# EAGLE design ThousandSunny (EAGLE 9.6.2)
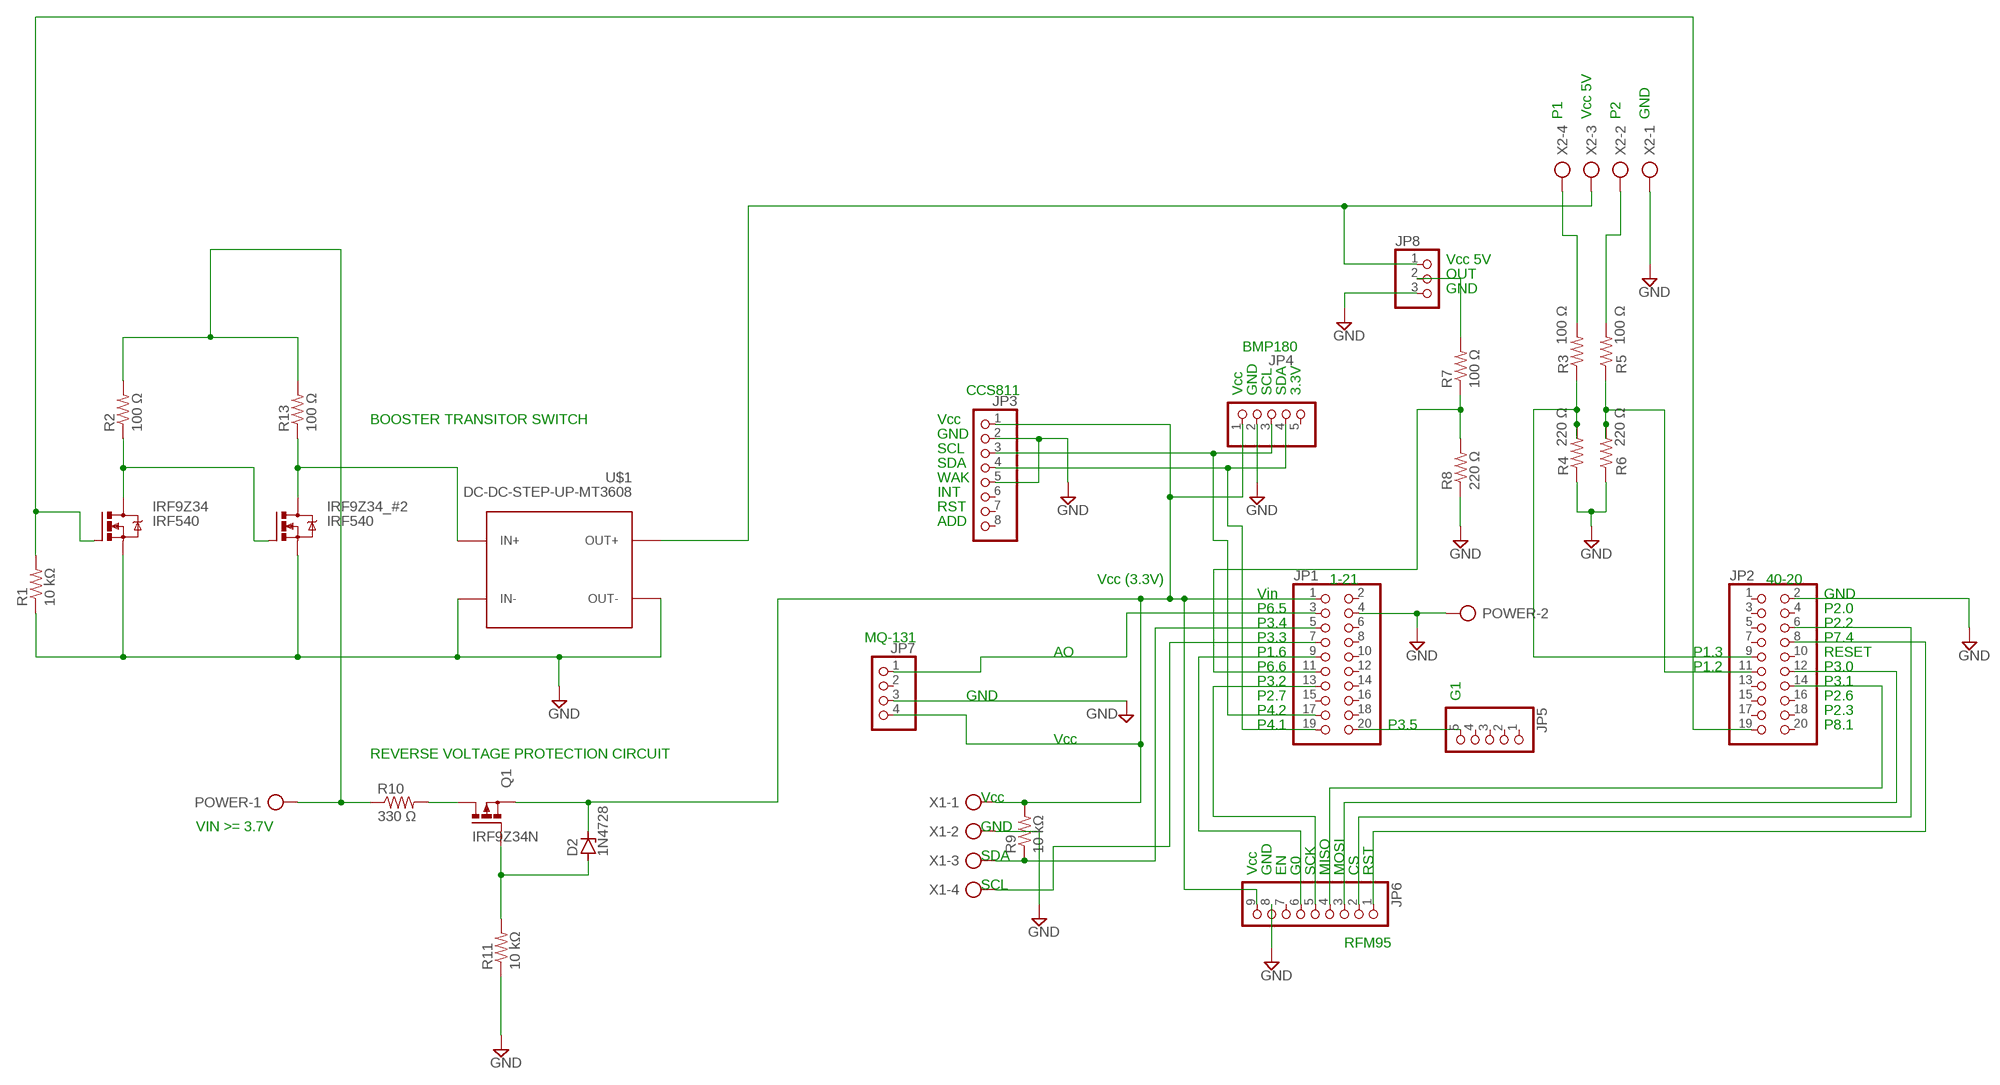
[diagram p0: schematic, sheet 1]

## Parts
D2  1N4728  [DO41Z10]
IRF9Z34  IRF540  [TO220BV]
IRF9Z34_#2  IRF540  [TO220BV]
JP1  PINHD-2X10  [2X10]
JP2  PINHD-2X10  [2X10]
JP3  PINHD-1X8  [1X08]
JP4  PINHD-1X5  [1X05]
JP5  PINHD-1X5  [1X05]
JP6  PINHD-1X9  [1X09]
JP7  PINHD-1X4  [1X04]
JP8  PINHD-1X3  [1X03]
POWER  AK300/2  [AK300/2]
Q1  IRF9Z34N  PMOSFET_PTO220BV  [TO220BV]
R1  10 kΩ  R-US_0204/7  [0204/7]
R2  100 Ω  R-US_0204/7  [0204/7]
R3  100 Ω  R-US_0204/7  [0204/7]
R4  220 Ω  R-US_0204/7  [0204/7]
R5  100 Ω  R-US_0204/7  [0204/7]
R6  220 Ω  R-US_0204/7  [0204/7]
R7  100 Ω  R-US_0204/7  [0204/7]
R8  220 Ω  R-US_0204/7  [0204/7]
R9  10 kΩ  R-US_0204/7  [0204/7]
R10  330 Ω  R-US_0204/7  [0204/7]
R11  10 kΩ  R-US_0204/7  [0204/7]
R13  100 Ω  R-US_0204/7  [0204/7]
U$1  DC-DC-STEP-UP-MT3608  [DC-DC-STEP-UP-MT3608]
X1  AK300/4  [AK300/4]
X2  AK300/4  [AK300/4]

## Nets
ANODE: D2.A Q1.G R11.2
BATTERY: POWER.1 R2.2 R10.1 R13.2
D1->G2: IRF9Z34.D IRF9Z34_#2.G R2.1
D2->VIN: IRF9Z34_#2.D R13.1 U$1.IN+
DRAIN_Q1: Q1.D R10.2
DUST_P1: JP2.9 R3.1 R4.2
DUST_P2: JP2.11 R5.1 R6.2
G1: JP1.20 JP5.5
GND: IRF9Z34.S IRF9Z34_#2.S JP1.4 JP2.2 JP3.2 JP3.5 JP4.2 JP6.8 JP7.3 JP8.3 POWER.2 R1.1 R4.1 R6.1 R8.1 R11.1 U$1.IN- U$1.OUT- X1.2 X2.1
MISO: JP2.14 JP6.4
MOSI: JP2.12 JP6.3
O3: JP1.3 JP7.1
P8.2: IRF9Z34.G JP2.19 R1.2
RAW_P1: R3.2 X2.4
RAW_P2: R5.2 X2.2
RAW_SOLAR: JP8.2 R7.2
RFM95_RST: JP2.8 JP6.1
RFM95W_CS: JP2.6 JP6.2
RFM95W_G0: JP1.9 JP6.6
SCK: JP1.13 JP6.5
SCL: JP1.17 JP3.3 JP4.3
SDA: JP1.19 JP3.4 JP4.4
SHT_CLOCK: JP1.7 X1.4
SHT_DATA: JP1.5 R9.1 X1.3
SOLAR: JP1.11 R7.1 R8.2
VIN->DUST: JP8.1 U$1.OUT+ X2.3
VZ->3.3V: D2.C JP1.1 JP3.1 JP4.1 JP6.9 JP7.4 Q1.S R9.2 X1.1
Unconnected: JP1.2 JP1.6 JP1.8 JP1.10 JP1.12 JP1.14 JP1.15 JP1.16 JP1.18 JP2.1 JP2.3 JP2.4 JP2.5 JP2.7 JP2.10 JP2.13 JP2.15 JP2.16 JP2.17 JP2.18 JP2.20 JP3.6 JP3.7 JP3.8 JP4.5 JP5.1 JP5.2 JP5.3 JP5.4 JP6.7 JP7.2

## Notes on the sheet
- P1 | Vcc 5V | P2 | GND
- Vcc 5V
- OUT
- GND
- BMP180
- CCS811 | Vcc | GND | SCL | SDA | 3.3V
- BOOSTER TRANSITOR SWITCH | Vcc
- GND
- SCL
- SDA
- WAK
- INT
- RST
- ADD
- Vcc (3.3V) | 1-21 | 40-20
- Vin | GND
- P6.5 | P2.0
- P3.4 | P2.2
- MQ-131 | P3.3 | P7.4
- AO | P1.6 | P1.3 | RESET
- P6.6 | P1.2 | P3.0
- P3.2 | P3.1
- GND | P2.7 | G1 | P2.6
- P4.2 | P2.3
- P4.1 | P3.5 | P8.1
- Vcc
- REVERSE VOLTAGE PROTECTION CIRCUIT
- Vcc
- VIN >= 3.7V | GND
- SDA
- Vcc | GND | EN | G0 | SCK | MISO | MOSI | CS | RST
- SCL
- RFM95

## Library data of the parts
D2 = diode:1N4728: Z DIODE 3.3 V, 1W, 5 percent
IRF9Z34 IRF9Z34_#2 = transistor-power:IRF540: HEXFET Power MOSFET
JP1 JP2 = pinhead:PINHD-2X10: PIN HEADER
JP3 = pinhead:PINHD-1X8: PIN HEADER
JP4 JP5 = pinhead:PINHD-1X5: PIN HEADER
JP6 = pinhead:PINHD-1X9: PIN HEADER
JP7 = pinhead:PINHD-1X4: PIN HEADER
JP8 = pinhead:PINHD-1X3: PIN HEADER
POWER = con-ptr500:AK300/2: CONNECTOR; OC_FARNELL: unknown; OC_NEWARK: unknown
Q1 = transistor-power:PMOSFET_P: Power MOSFET P-Channel
R1-R11 R13 = resistor:R-US_: RESISTOR, American symbol
U$1 = dc-dc-boost-2a-microusb-mt3608:DC-DC-STEP-UP-MT3608: DC/DC Step-Up Regulator based on MT3608 chip MT3608 datasheet available here: https://www.olimex.com/Products/Breadboarding/BB-PWR-3608/resources/MT3608.pdf Click here to find device on ebay.com <http://www.ebay.com/sch/mt3608+module>
X1 X2 = con-ptr500:AK300/4: CONNECTOR; OC_FARNELL: unknown; OC_NEWARK: unknown

## Board
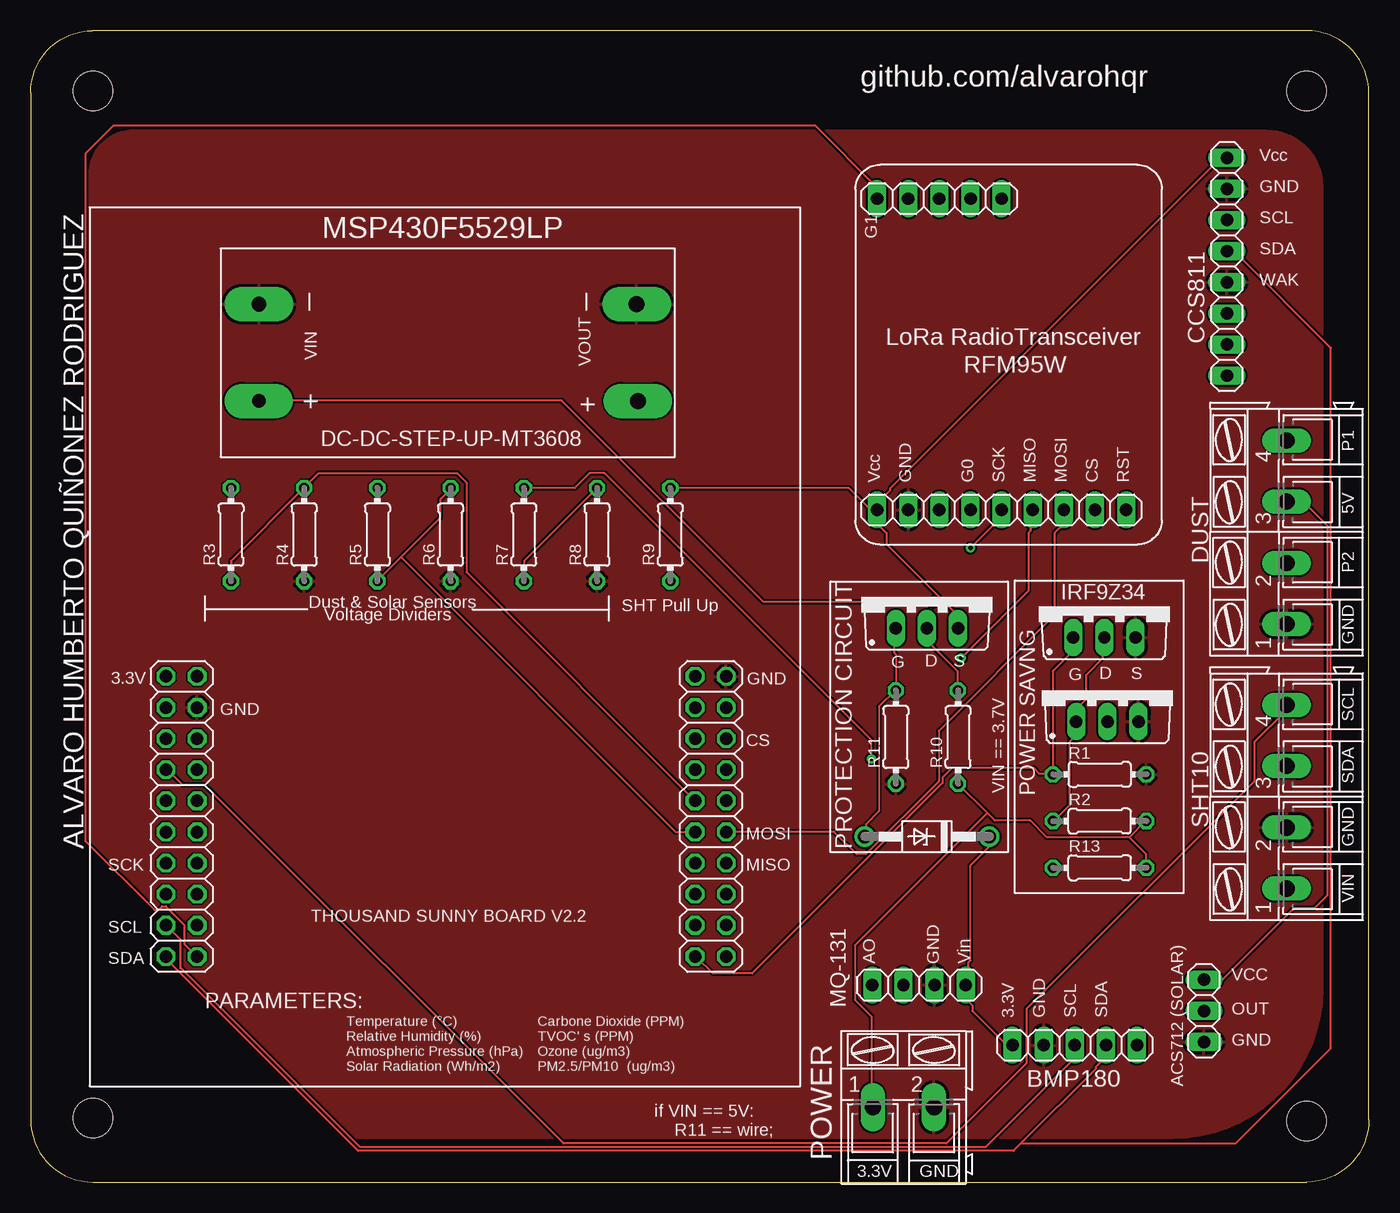
[diagram p1: board, top side]
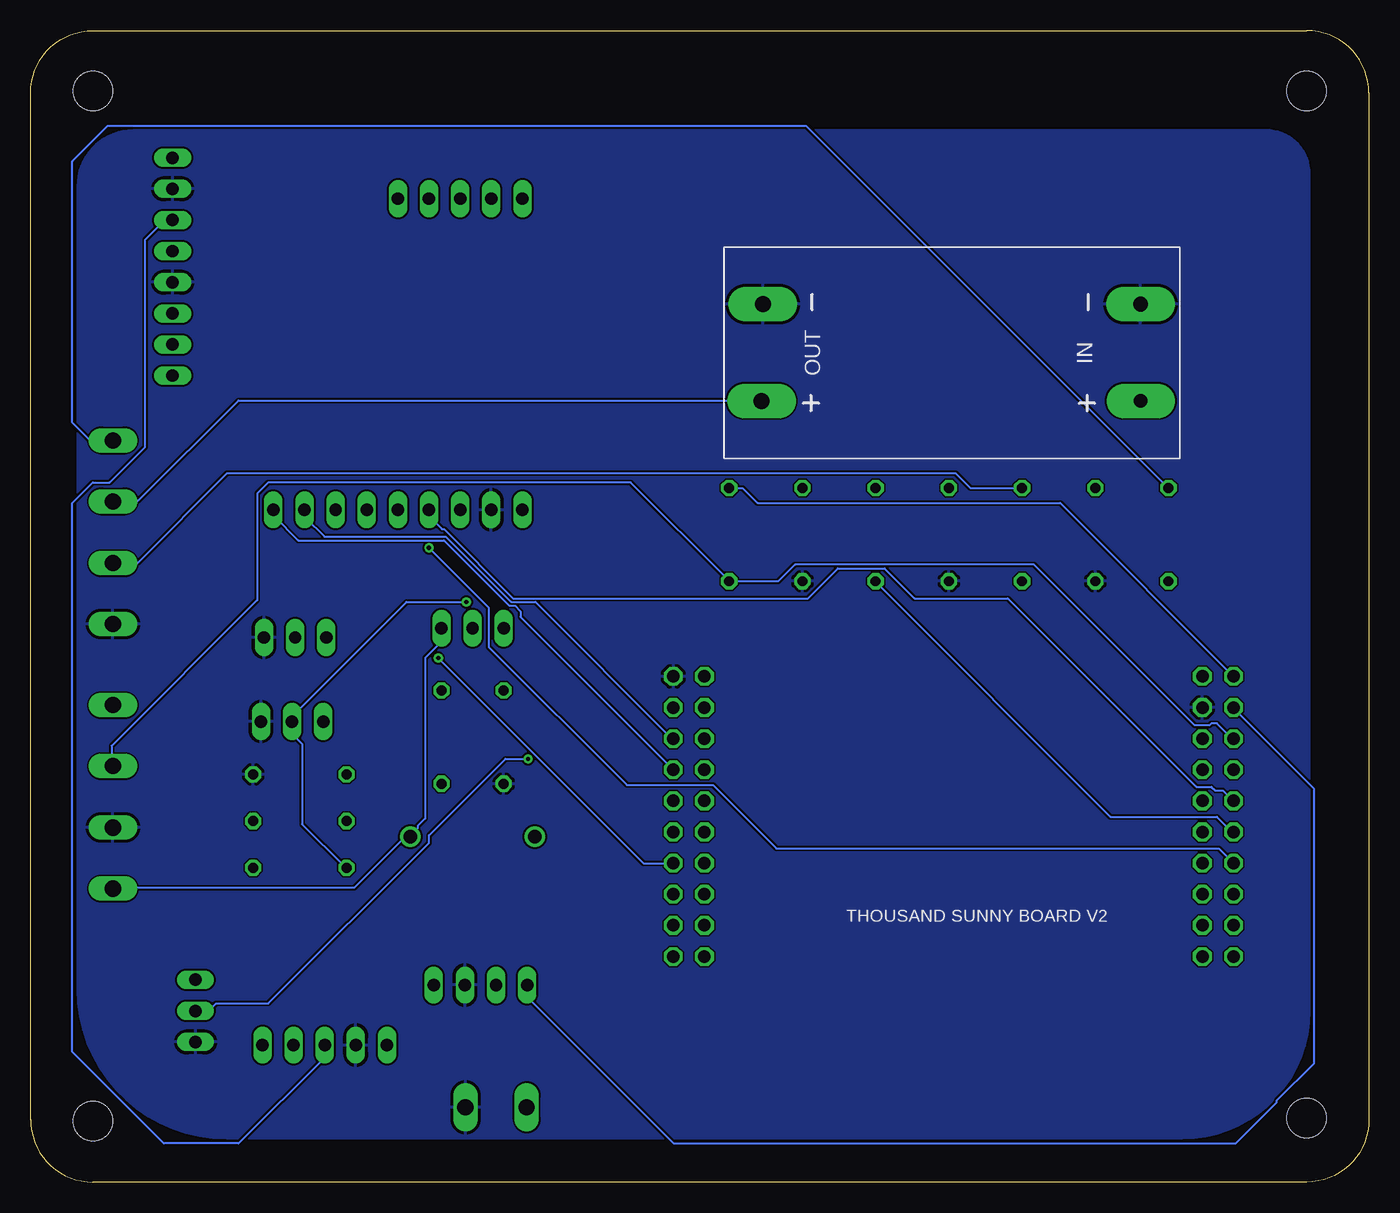
[diagram p2: board, bottom side, seen from below]

Size 109.22 x 93.98 mm. Coordinates in mm from the lower left corner, seen from the top.
Outline: 5.08,0 104.14,0 arc90 109.22,5.08 109.22,88.9 arc90 104.14,93.98 5.08,93.98 arc90 0,88.9 0,5.08 arc90 5.08,0
Copper layers (1*16): Top 0.035mm / dielectric 1.5mm / Bottom 0.035mm
Design rules "default *": minimum track width 6mil, minimum drill 0.35mm, track to track 6mil, track to pad 6mil, pad to pad 6mil, via to via 6mil, smd to smd 6mil, copper to edge 40mil, drill to drill 6mil, minimum pad ring 10mil, minimum via ring 8mil, stop-mask expansion 4mil, vias tented up to drill 0mil, thermal gap 10mil
Holes 3.2 mm at 5.08,89.06 104.14,89.06 5.08,5.24 104.14,4.99
tKeepout: area 2.8,86.8 to 7.3,91.3; area 101.9,86.8 to 106.4,91.3; area 2.8,3 to 7.3,7.5; area 101.9,2.8 to 106.4,7.2
bKeepout: area 2.8,86.8 to 7.3,91.3; area 101.9,86.8 to 106.4,91.3; area 2.8,3 to 7.3,7.5; area 101.9,2.8 to 106.4,7.2
tRestrict: area 2.8,86.8 to 7.3,91.3; area 101.9,86.8 to 106.4,91.3; area 2.8,3 to 7.3,7.5; area 101.9,2.8 to 106.4,7.2
bRestrict: area 2.8,86.8 to 7.3,91.3; area 101.9,86.8 to 106.4,91.3; area 2.8,3 to 7.3,7.5; area 101.9,2.8 to 106.4,7.2
vRestrict: area 2.8,86.8 to 7.3,91.3; area 101.9,86.8 to 106.4,91.3; area 2.8,3 to 7.3,7.5; area 101.9,2.8 to 106.4,7.2

### Footprints (pad centres in the part's own frame; a part is rotated, then mirrored left to right if it is on the bottom)
DO41Z10 = drill 1.118: A 5.08,0; C -5.08,0
TO220BV = drill 1.016 long: D 0,-2.54; G -2.54,-2.54; S 2.54,-2.54
2X10 = drill 1.016 octagon: 1 -11.43,-1.27; 2 -11.43,1.27; 3 -8.89,-1.27; 4 -8.89,1.27; 5 -6.35,-1.27; 6 -6.35,1.27; 7 -3.81,-1.27; 8 -3.81,1.27; 9 -1.27,-1.27; 10 -1.27,1.27; 11 1.27,-1.27; 12 1.27,1.27; 13 3.81,-1.27; 14 3.81,1.27; 15 6.35,-1.27; 16 6.35,1.27; 17 8.89,-1.27; 18 8.89,1.27; 19 11.43,-1.27; 20 11.43,1.27
1X08 = drill 1.016 long: 1 -8.89,0; 2 -6.35,0; 3 -3.81,0; 4 -1.27,0; 5 1.27,0; 6 3.81,0; 7 6.35,0; 8 8.89,0
1X05 = drill 1.016 long: 1 -5.08,0; 2 -2.54,0; 3 0,0; 4 2.54,0; 5 5.08,0
1X09 = drill 1.016 long: 1 -10.16,0; 2 -7.62,0; 3 -5.08,0; 4 -2.54,0; 5 0,0; 6 2.54,0; 7 5.08,0; 8 7.62,0; 9 10.16,0
1X04 = drill 1.016 long: 1 -3.81,0; 2 -1.27,0; 3 1.27,0; 4 3.81,0
1X03 = drill 1.016 long: 1 -2.54,0; 2 0,0; 3 2.54,0
AK300/2 = drill 1.321 long: 1 -2.515,0; 2 2.489,0
0204/7 = drill 0.813 octagon: 1 -3.81,0; 2 3.81,0
DC-DC-STEP-UP-MT3608 = drill 1.1 pad 2.8 long: IN+ -12.884,3.813 | drill 1.2 pad 2.8 long: IN- -12.859,-4.092 | drill 1.3 pad 2.8 long: OUT+ 18.066,3.813; OUT- 17.964,-4.092
AK300/4 = drill 1.321 long: 1 -7.493,0; 2 -2.515,0; 3 2.515,0; 4 7.493,0

### Placement (x,y rotation side)
D2  73.15,28.19 180 top
IRF9Z34  87.63,46.99 0 top
IRF9Z34_#2  87.88,40.13 0 top
JP1  12.32,29.84 270 top
JP2  55.5,29.84 270 top
JP3  97.63,74.71 270 top
JP4  85.22,11.18 0 top
JP5  74.17,80.26 180 top
JP6  79.25,54.86 180 top
JP7  72.5,16.08 0 top
JP8  95.76,13.97 270 top
POWER  71.25,6.1 0 top
Q1  73.15,47.75 0 top
R1  87.25,33.27 180 top
R2  87.25,29.46 0 top
R3  16.35,52.85 90 top
R4  22.33,52.85 90 top
R5  28.3,52.85 90 top
R6  34.28,52.85 90 top
R7  40.25,52.85 90 top
R8  46.23,52.85 90 top
R9  52.21,52.85 90 top
R10  75.69,36.32 90 top
R11  70.61,36.32 90 top
R13  87.25,25.65 0 top
U$1  31.5,67.56 180 bottom
X1  102.5,31.45 90 top
X2  102.5,53.04 90 top

### Tracks (layer width: path | path; a pad name or v marks a point on that pad's centre or on a via)
ANODE
  Top 0.152: 70.61,40.18 70.61,43.08 70.46,43.23 70.46,45.06 Q1.G | 70.61,40.18 69.24,38.81 69.24,30.28 68.17,29.21 68.17,28.3 D2.A | 70.61,40.18 R11.2
BATTERY
  Top 0.152: 78.08,30.12 78.69,29.52 81.58,29.52 82.96,28.14 89.66,28.14 | 78.08,30.12 R10.1 | 89.66,28.14 91.03,29.52 R2.2 | 89.66,28.14 91.03,26.77 91.03,25.7 R13.2 | 78.08,30.12 67.26,19.3 67.26,14.88 68.63,13.51 68.63,6.2 POWER.1
D1->G2
  Top 0.152: R2.1 83.57,29.52 84.78,30.73 84.78,35.92 85.24,36.37 85.24,37.59 IRF9Z34_#2.G 85.39,37.59 85.39,38.66 86.16,39.42 86.16,41.4 87.53,42.77 87.53,44.45 IRF9Z34.D
D2->VIN  (via drill 0.35)
  Top 0.152: v73.66,47.35 59.79,47.35 43.33,63.8 18.64,63.8 U$1.IN+
  Bottom 0.152: 87.83,37.59 87.83,36.52 87.07,35.76 87.07,29.21 83.57,25.7 R13.1 | v73.66,47.35 78.54,47.35 87.83,38.05 87.83,37.59 | 87.83,37.59 IRF9Z34_#2.D
DRAIN_Q1
  Top 0.152: R10.2 75.64,40.18 75.64,41.71 73.2,44.14 73.2,45.21 Q1.D
DUST_P1
  Top 0.152: R3.1 16.36,49.17 16.36,50.7 22.3,56.64 R4.2 22.45,56.79 23.52,57.86 34.8,57.86 35.56,57.1 35.56,49.78 JP2.9
DUST_P2
  Top 0.152: 30.23,51 33.43,54.2 33.43,55.73 34.34,56.64 R6.2 | 30.23,51 28.4,49.17 R5.1 | 30.23,51 52.63,28.6 54.15,28.6 JP2.11
G1
  Top 0.152: JP1.20 12.55,19.46 12.55,20.98 11.02,22.5 10.72,22.5 10.41,22.2 10.11,22.2 4.47,27.84 4.47,83.92 6.76,86.21 64.06,86.21 69.09,81.18 JP5.5
GND
  pour Top: 4.83,13.97 4.83,82.3 arc-90 8.38,85.85 100.84,85.85 arc-90 105.41,81.28 105.41,15.75 arc-90 93.22,3.56 15.24,3.56 arc-90
  pour Bottom: 4.83,13.97 4.83,82.3 arc-90 8.38,85.85 100.84,85.85 arc-90 105.41,81.28 105.41,15.75 arc-90 93.22,3.56 15.24,3.56 arc-90
MISO  (via drill 0.35)
  Top 0.152: v75.95,42.77 81.43,48.26 81.43,52.98 81.58,53.14 81.58,53.29 81.74,53.44 81.74,54.81 JP6.4
  Bottom 0.152: v75.95,42.77 59.18,26.01 56.9,26.01 JP2.14
MOSI
  Top 0.152: JP6.3 84.33,53.75 83.57,52.98 83.57,46.28 74.12,36.83 74.12,32.72 68.17,26.77 67.41,26.77 65.58,28.6 56.9,28.6 JP2.12
O3
  Bottom 0.152: JP1.3 11.02,38.66 4.47,32.11 4.47,9.7 7.52,6.66 7.52,6.5 10.87,3.15 56.74,3.15 68.63,15.04 68.63,15.95 JP7.1
P8.2
  Top 0.152: 83.41,33.33 83.41,41.71 85.09,43.38 IRF9Z34.G | 83.41,33.33 82.35,33.33 81.89,33.78 75.18,33.78 74.42,33.02 74.42,32.56 58.88,17.02 55.68,17.02 54.3,18.39 JP2.19 | 83.41,33.33 R1.2
RAW_P1
  Bottom 0.152: R3.2 16.36,56.79 16.66,57.1 16.81,57.1 45.92,86.21 102.92,86.21 105.82,83.31 105.82,61.98 104.44,60.6 102.62,60.6 X2.4
RAW_P2
  Bottom 0.152: R5.2 28.4,56.64 32.51,56.64 33.73,57.86 93.17,57.86 100.48,50.55 102.46,50.55 X2.2
RAW_SOLAR  (via drill 0.35)
  Top 0.152: v68.63,34.54 68.63,36.07 46.84,57.86 45.62,57.86 44.4,56.64 40.28,56.64 R7.2
  Bottom 0.152: v68.63,34.54 70.46,34.54 76.71,28.3 76.71,27.69 89.81,14.58 94.08,14.58 94.69,13.97 JP8.2
RFM95_RST
  Bottom 0.152: JP2.8 69.24,46.13 69.24,46.58 69.7,47.04 70.16,47.04 75.49,52.38 87.38,52.38 89.36,54.36 89.36,54.81 JP6.1
RFM95W_CS
  Bottom 0.152: JP2.6 56.9,36.22 68.02,47.35 70,47.35 75.34,52.68 85.24,52.68 86.77,54.2 86.77,54.81 JP6.2
RFM95W_G0
  Bottom 0.152: JP6.6 76.71,54.36 75.64,53.29 75.49,53.29 69.85,47.65 45.77,47.65 43.33,50.09 39.52,50.09 37.08,47.65 29.46,47.65 14.07,32.26 12.85,32.26 12.55,31.95 11.94,31.95 11.18,31.19 JP1.9
SCK  (via drill 0.35)
  Top 0.152: v76.71,51.77 79.15,54.2 79.15,54.81 JP6.5
  Bottom 0.152: JP1.13 12.24,27.23 48.36,27.23 53.54,32.41 60.55,32.41 71.83,43.69 71.83,46.89 v76.71,51.77
SCL
  Top 0.152: JP1.17 12.24,19.76 12.24,17.48 26.87,2.85 77.93,2.85 85.09,10.01 85.09,11.07 JP4.3
  Bottom 0.152: JP3.3 97.74,78.44 98.35,78.44 99.87,76.91 99.87,59.99 102.77,57.1 104.14,57.1 105.82,55.42 105.82,10.62 98.35,3.15 92.25,3.15 85.24,10.16 85.24,11.07 JP4.3
SDA
  Top 0.152: 80.82,3.15 86.92,9.25 86.92,9.4 87.68,10.16 87.68,11.07 JP4.4 | 80.82,3.15 80.21,2.54 26.72,2.54 11.18,18.09 11.18,18.39 JP1.19 | 80.82,3.15 98.35,3.15 106.12,10.92 106.12,68.07 98.35,75.84 97.74,75.84 JP3.4
SHT_CLOCK
  Top 0.152: JP1.7 11.18,33.63 12.39,32.41 14.22,32.41 43.48,3.15 74.73,3.15 81.28,9.7 81.28,14.12 99.87,32.72 99.87,35.92 102.46,38.51 102.46,38.81 X1.4
SHT_DATA
  Bottom 0.152: JP1.5 11.18,36.22 12.39,37.44 12.85,37.44 13,37.29 14.22,37.29 27.33,50.39 46.84,50.39 48.21,49.02 52.17,49.02 R9.1 52.32,49.17 60.25,57.1 89.81,57.1 90.73,56.19 90.73,47.5 102.62,35.61 102.62,34.09 X1.3
SOLAR
  Top 0.152: R7.1 40.28,49.17 40.28,50.7 46.23,56.64 R8.2
  Bottom 0.152: JP1.11 11.18,28.6 12.39,29.82 21.08,29.82 40.28,49.02 R7.1
VIN->DUST
  Top 0.152: JP8.1 95.76,16.56 97.28,16.56 103.07,22.35 104.75,22.35 105.82,23.42 105.82,53.59 103.99,55.42 102.62,55.42 X2.3
  Bottom 0.152: U$1.OUT+ 49.58,63.8 92.25,63.8 100.48,55.57 102.46,55.57 X2.3
VZ->3.3V
  Top 0.152: JP4.1 80.06,11.23 79.6,11.23 76.86,13.97 76.86,14.43 76.4,14.88 76.4,15.95 JP7.4 76.4,16.1 76.56,16.26 76.56,17.93 76.71,18.09 76.71,25.86 78.23,27.38 D2.C | 69.09,54.97 68.48,54.97 66.8,56.64 52.32,56.64 R9.2 | Q1.S 75.64,45.21 75.64,46.28 69.85,52.07 69.85,52.98 69.09,53.75 JP6.9 69.09,54.97 | 69.09,54.97 69.09,55.42 70.16,56.49 70.16,56.64 96.98,83.46 97.59,83.46 JP3.1
  Bottom 0.152: X1.1 102.46,24.03 82.8,24.03 78.69,28.14 78.23,28.14 D2.C 78.23,28.3 77.62,28.9 77.62,29.06 77.01,29.67 77.01,42.77 75.79,43.99 75.79,45.21 Q1.S | JP1.1 25.2,55.42 49.89,55.42 51.1,56.64 52.17,56.64 R9.2

### Text on the board
tPlace: github.com/alvarohqr | Vcc | GND | SCL | MSP430F5529LP | G1 | SDA | WAK | _ | _ | LoRa RadioTransceiver | VIN | VOUT | RFM95W | + | + | P1 | Vcc | GND | G0 | SCK | MISO | MOSI | CS | RST | 5V | DUST | P2 | Dust & Solar Sensors | SHT Pull Up | Voltage Dividers | GND | D | G | S | 3.3V | GND | G | D | S | GND | SCL | CS | SDA | VIN == 3.7V | POWER SAVNG | SHT10 | ALVARO HUMBERTO QUIÑONEZ RODRIGUEZ | MOSI | PROTECTION CIRCUIT | GND | SCK | MISO | VIN | SCL | ACS712 (SOLAR) | SDA | AO | GND | Vin | VCC | PARAMETERS: | 3.3V | GND | SCL | SDA | OUT | GND | Temperature (°C) / Relative Humidity (%) / Atmospheric Pressure (hPa) / Solar Radiation (Wh/m2) | Carbone Dioxide (PPM) / TVOC' s (PPM) / Ozone (ug/m3) / PM2.5/PM10 (ug/m3) | BMP180 | if VIN == 5V: / R11 == wire; | POWER
tNames: CCS811 | THOUSAND SUNNY BOARD V2.2 | MQ-131 | 3.3V | GND
bNames: THOUSAND SUNNY BOARD V2